# EAGLE schematic wiring (EAGLE 7.4.0)
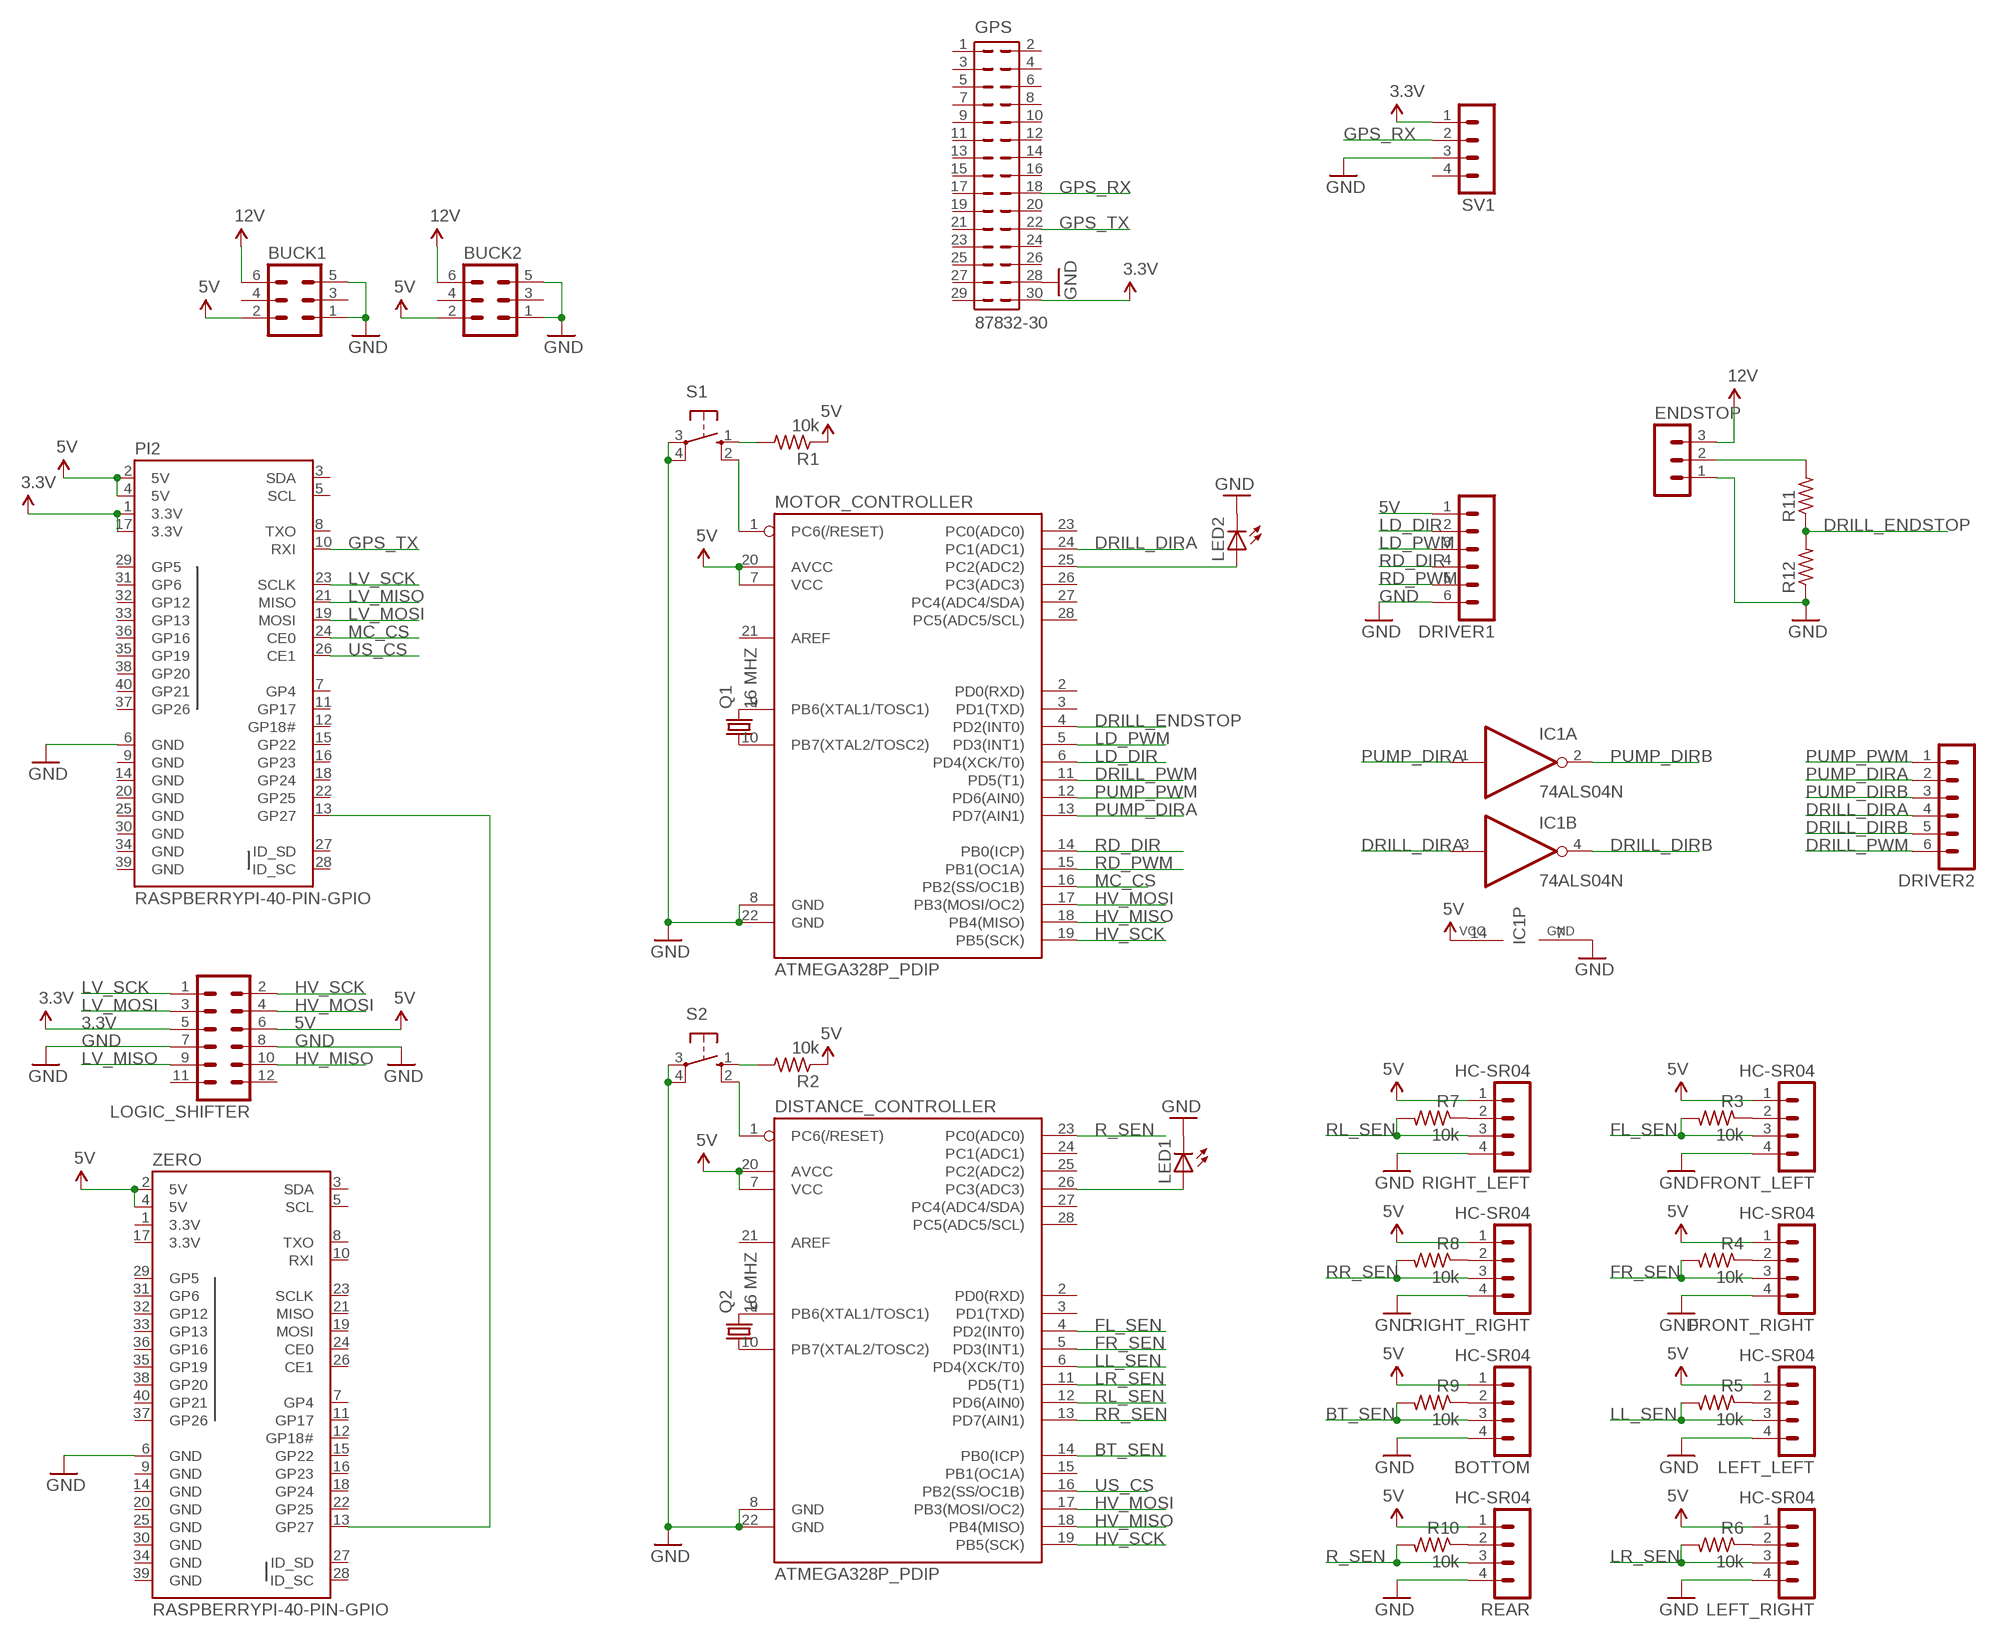
[diagram p0: schematic, sheet 1]

## Parts
BOTTOM  HC-SR04  MA04-1  [MA04-1]
BUCK1  MA03-2  [MA03-2]
BUCK2  MA03-2  [MA03-2]
DISTANCE_CONTROLLER  ATMEGA328P_PDIP  [DIL28-3]
DRIVER1  MA06-1  [MA06-1]
DRIVER2  MA06-1  [MA06-1]
ENDSTOP  MA03-1  [MA03-1]
FRONT_LEFT  HC-SR04  MA04-1  [MA04-1]
FRONT_RIGHT  HC-SR04  MA04-1  [MA04-1]
GPS  87832-30  [87832-30]
IC1  74ALS04N  [DIL14]
LED1  LED3MM  [LED3MM]
LED2  LED3MM  [LED3MM]
LEFT_LEFT  HC-SR04  MA04-1  [MA04-1]
LEFT_RIGHT  HC-SR04  MA04-1  [MA04-1]
LOGIC_SHIFTER  MA06-2  [MA06-2]
MOTOR_CONTROLLER  ATMEGA328P_PDIP  [DIL28-3]
PI2  RASPBERRYPI-40-PIN-GPIO  [2X20-SHROUDED]
Q1  16 MHZ  CRYSTALHC49S  [HC49/S]
Q2  16 MHZ  CRYSTALHC49S  [HC49/S]
R1  10k  R-US_0204/2V  [0204V]
R2  10k  R-US_0204/2V  [0204V]
R3  10k  R-US_0204/2V  [0204V]
R4  10k  R-US_0204/2V  [0204V]
R5  10k  R-US_0204/2V  [0204V]
R6  10k  R-US_0204/2V  [0204V]
R7  10k  R-US_0204/2V  [0204V]
R8  10k  R-US_0204/2V  [0204V]
R9  10k  R-US_0204/2V  [0204V]
R10  10k  R-US_0204/2V  [0204V]
R11  R-US_0204/2V  [0204V]
R12  R-US_0204/2V  [0204V]
REAR  HC-SR04  MA04-1  [MA04-1]
RIGHT_LEFT  HC-SR04  MA04-1  [MA04-1]
RIGHT_RIGHT  HC-SR04  MA04-1  [MA04-1]
S1  10-XX  [B3F-10XX]
S2  10-XX  [B3F-10XX]
SV1  MA04-1  [MA04-1]
ZERO  RASPBERRYPI-40-PIN-GPIO  [2X20-SHROUDED]

## Nets
3.3V: GPS.30 LOGIC_SHIFTER.5 PI2.1(3.3V) PI2.17(3.3V) SV1.1
5V: BOTTOM.1 BUCK1.2 BUCK2.2 DISTANCE_CONTROLLER.7(VCC) DISTANCE_CONTROLLER.20(AVCC) DRIVER1.1 FRONT_LEFT.1 FRONT_RIGHT.1 IC1.14(P:VCC) LEFT_LEFT.1 LEFT_RIGHT.1 LOGIC_SHIFTER.6 MOTOR_CONTROLLER.7(VCC) MOTOR_CONTROLLER.20(AVCC) PI2.2(5V) PI2.4(5V) R1.1 R2.1 REAR.1 RIGHT_LEFT.1 RIGHT_RIGHT.1 ZERO.2(5V) ZERO.4(5V)
12V: BUCK1.6 BUCK2.6 ENDSTOP.3
BT_SEN: BOTTOM.3 DISTANCE_CONTROLLER.14(PB0(ICP)) R9.2
DRILL_DIRA: DRIVER2.4 IC1.3(B:I) MOTOR_CONTROLLER.24(PC1(ADC1))
DRILL_DIRB: DRIVER2.5 IC1.4(B:O)
DRILL_ENDSTOP: MOTOR_CONTROLLER.4(PD2(INT0)) R11.1 R12.2
DRILL_PWM: DRIVER2.6 MOTOR_CONTROLLER.11(PD5(T1))
FL_SEN: DISTANCE_CONTROLLER.4(PD2(INT0)) FRONT_LEFT.3 R3.2
FR_SEN: DISTANCE_CONTROLLER.5(PD3(INT1)) FRONT_RIGHT.3 R4.2
GND: BOTTOM.4 BUCK1.1 BUCK1.5 BUCK2.1 BUCK2.5 DISTANCE_CONTROLLER.8(GND) DISTANCE_CONTROLLER.22(GND) DRIVER1.6 ENDSTOP.1 FRONT_LEFT.4 FRONT_RIGHT.4 GPS.28 IC1.7(P:GND) LED1.K(C) LED2.K(C) LEFT_LEFT.4 LEFT_RIGHT.4 LOGIC_SHIFTER.7 LOGIC_SHIFTER.8 MOTOR_CONTROLLER.8(GND) MOTOR_CONTROLLER.22(GND) PI2.6(GND) R12.1 REAR.4 RIGHT_LEFT.4 RIGHT_RIGHT.4 S1.3(P) S1.4(P1) S2.3(P) S2.4(P1) SV1.3 ZERO.6(GND)
GPS_RX: GPS.18 SV1.2
GPS_TX: GPS.22 PI2.10(RXI)
HV_MISO: DISTANCE_CONTROLLER.18(PB4(MISO)) LOGIC_SHIFTER.10 MOTOR_CONTROLLER.18(PB4(MISO))
HV_MOSI: DISTANCE_CONTROLLER.17(PB3(MOSI/OC2)) LOGIC_SHIFTER.4 MOTOR_CONTROLLER.17(PB3(MOSI/OC2))
HV_SCK: DISTANCE_CONTROLLER.19(PB5(SCK)) LOGIC_SHIFTER.2 MOTOR_CONTROLLER.19(PB5(SCK))
LD_DIR: DRIVER1.2 MOTOR_CONTROLLER.6(PD4(XCK/T0))
LD_PWM: DRIVER1.3 MOTOR_CONTROLLER.5(PD3(INT1))
LL_SEN: DISTANCE_CONTROLLER.6(PD4(XCK/T0)) LEFT_LEFT.3 R5.2
LR_SEN: DISTANCE_CONTROLLER.11(PD5(T1)) LEFT_RIGHT.3 R6.2
LV_MISO: LOGIC_SHIFTER.9 PI2.21(MISO)
LV_MOSI: LOGIC_SHIFTER.3 PI2.19(MOSI)
LV_SCK: LOGIC_SHIFTER.1 PI2.23(SCLK)
MC_CS: MOTOR_CONTROLLER.16(PB2(SS/OC1B)) PI2.24(CE0)
N$1: R1.2 S1.1(S)
N$2: MOTOR_CONTROLLER.1(PC6(/RESET)) S1.2(S1)
N$3: DISTANCE_CONTROLLER.1(PC6(/RESET)) S2.2(S1)
N$4: DISTANCE_CONTROLLER.26(PC3(ADC3)) LED1.A
N$5: LED2.A MOTOR_CONTROLLER.25(PC2(ADC2))
N$6: R2.2 S2.1(S)
N$7: FRONT_RIGHT.2 R4.1
N$8: MOTOR_CONTROLLER.9(PB6(XTAL1/TOSC1)) Q1.2
N$9: FRONT_LEFT.2 R3.1
N$10: ENDSTOP.2 R11.2
N$11: LEFT_LEFT.2 R5.1
N$12: MOTOR_CONTROLLER.10(PB7(XTAL2/TOSC2)) Q1.1
N$13: LEFT_RIGHT.2 R6.1
N$14: DISTANCE_CONTROLLER.9(PB6(XTAL1/TOSC1)) Q2.2
N$15: R7.1 RIGHT_LEFT.2
N$16: DISTANCE_CONTROLLER.10(PB7(XTAL2/TOSC2)) Q2.1
N$17: R8.1 RIGHT_RIGHT.2
N$18: PI2.13(GP27) ZERO.13(GP27)
N$19: BOTTOM.2 R9.1
N$21: R10.1 REAR.2
PUMP_DIRA: DRIVER2.2 IC1.1(A:I) MOTOR_CONTROLLER.13(PD7(AIN1))
PUMP_DIRB: DRIVER2.3 IC1.2(A:O)
PUMP_PWM: DRIVER2.1 MOTOR_CONTROLLER.12(PD6(AIN0))
R_SEN: DISTANCE_CONTROLLER.23(PC0(ADC0)) R10.2 REAR.3
RD_DIR: DRIVER1.4 MOTOR_CONTROLLER.14(PB0(ICP))
RD_PWM: DRIVER1.5 MOTOR_CONTROLLER.15(PB1(OC1A))
RL_SEN: DISTANCE_CONTROLLER.12(PD6(AIN0)) R7.2 RIGHT_LEFT.3
RR_SEN: DISTANCE_CONTROLLER.13(PD7(AIN1)) R8.2 RIGHT_RIGHT.3
US_CS: DISTANCE_CONTROLLER.16(PB2(SS/OC1B)) PI2.26(CE1)
Unconnected: BUCK1.3 BUCK1.4 BUCK2.3 BUCK2.4 DISTANCE_CONTROLLER.2(PD0(RXD)) DISTANCE_CONTROLLER.3(PD1(TXD)) DISTANCE_CONTROLLER.15(PB1(OC1A)) DISTANCE_CONTROLLER.21(AREF) DISTANCE_CONTROLLER.24(PC1(ADC1)) DISTANCE_CONTROLLER.25(PC2(ADC2)) DISTANCE_CONTROLLER.27(PC4(ADC4/SDA)) DISTANCE_CONTROLLER.28(PC5(ADC5/SCL)) GPS.1 GPS.2 GPS.3 GPS.4 GPS.5 GPS.6 GPS.7 GPS.8 GPS.9 GPS.10 GPS.11 GPS.12 GPS.13 GPS.14 GPS.15 GPS.16 GPS.17 GPS.19 GPS.20 GPS.21 GPS.23 GPS.24 GPS.25 GPS.26 GPS.27 GPS.29 IC1.5(C:I) IC1.6(C:O) IC1.8(D:O) IC1.9(D:I) IC1.10(E:O) IC1.11(E:I) IC1.12(F:O) IC1.13(F:I) LOGIC_SHIFTER.11 LOGIC_SHIFTER.12 MOTOR_CONTROLLER.2(PD0(RXD)) MOTOR_CONTROLLER.3(PD1(TXD)) MOTOR_CONTROLLER.21(AREF) MOTOR_CONTROLLER.23(PC0(ADC0)) MOTOR_CONTROLLER.26(PC3(ADC3)) MOTOR_CONTROLLER.27(PC4(ADC4/SDA)) MOTOR_CONTROLLER.28(PC5(ADC5/SCL)) PI2.3(SDA) PI2.5(SCL) PI2.7(GP4) PI2.8(TXO) PI2.11(GP17) PI2.12(GP18#) PI2.15(GP22) PI2.16(GP23) PI2.18(GP24) PI2.22(GP25) PI2.27(ID_SD) PI2.28(ID_SC) PI2.29(GP5) PI2.31(GP6) PI2.32(GP12) PI2.33(GP13) PI2.35(GP19) PI2.36(GP16) PI2.37(GP26) PI2.38(GP20) PI2.40(GP21) SV1.4 ZERO.3(SDA) ZERO.5(SCL) ZERO.7(GP4) ZERO.8(TXO) ZERO.10(RXI) ZERO.11(GP17) ZERO.12(GP18#) ZERO.15(GP22) ZERO.16(GP23) ZERO.18(GP24) ZERO.19(MOSI) ZERO.21(MISO) ZERO.22(GP25) ZERO.23(SCLK) ZERO.24(CE0) ZERO.26(CE1) ZERO.27(ID_SD) ZERO.28(ID_SC) ZERO.29(GP5) ZERO.31(GP6) ZERO.32(GP12) ZERO.33(GP13) ZERO.35(GP19) ZERO.36(GP16) ZERO.37(GP26) ZERO.38(GP20) ZERO.40(GP21)

## Power pins joined to a net without a drawn wire
3.3V: ZERO.1(3.3V) ZERO.17(3.3V)
GND: PI2.9(GND) PI2.14(GND) PI2.20(GND) PI2.25(GND) PI2.30(GND) PI2.34(GND) PI2.39(GND) ZERO.9(GND) ZERO.14(GND) ZERO.20(GND) ZERO.25(GND) ZERO.30(GND) ZERO.34(GND) ZERO.39(GND)

## Library data of the parts
BOTTOM FRONT_LEFT FRONT_RIGHT LEFT_LEFT LEFT_RIGHT REAR RIGHT_LEFT RIGHT_RIGHT SV1 = con-lstb:MA04-1: PIN HEADER; OC_FARNELL: unknown; OC_NEWARK: unknown
BUCK1 BUCK2 = con-lstb:MA03-2: PIN HEADER; OC_FARNELL: unknown; OC_NEWARK: unknown
DISTANCE_CONTROLLER MOTOR_CONTROLLER = SparkFun-DigitalIC:ATMEGA328P_PDIP: uC used in the Arduino 32kb flash, 1k EEPROM, 2k SRAM This is the through-hole version of this chip.
DRIVER1 DRIVER2 = con-lstb:MA06-1: PIN HEADER; OC_FARNELL: unknown; OC_NEWARK: unknown
ENDSTOP = con-lstb:MA03-1: PIN HEADER; OC_FARNELL: unknown; OC_NEWARK: unknown
GPS = con-molex:87832-30: Milli-Grid Header 2.00mm (.079") Pitch; OC_FARNELL: unknown; OC_NEWARK: unknown
IC1 = 74xx-us:74*04: Hex INVERTER
LED1 LED2 = led:LED: LED OSRAM: - CHIPLED LG R971, LG N971, LY N971, LG Q971, LY Q971, LO R971, LY R971 LH N974, LH R974 LS Q976, LO Q976, LY Q976 LO Q996 - Hyper CHIPLED LW Q18S LB Q993, LB Q99A, LB R99A - SideLED LS A670, LO A670, LY A670, LG A670, LP A670 LB A673, LV A673, LT A673, LW A673 LH A674 LY A675 LS A676, LA A676, LO A676, LY A676, LW A676 LS A679, LY A679, LG A679 - Hyper Micro SIDELED® LS Y876, LA Y876, LO Y876, LY Y876 LT Y87S - SmartLED LW L88C, LW L88S LB L89C, LB L89S, LG L890 LS L89K, LO L89K, LY L89K LS L896, LA L896, LO L896, LY L896 - TOPLED LS T670, LO T670, LY T670, LG T670, LP T670 LSG T670, LSP T670, LSY T670, LOP T670, LYG T670 LG T671, LOG T671, LSG T671 LB T673, LV T673, LT T673, LW T673 LH T674 LS T676, LA T676, LO T676, LY T676, LB T676, LH T676, LSB T676, LW T676 LB T67C, LV T67C, LT T67C, LS T67K, LO T67K, LY T67K, LW E67C LS E67B, LA E67B, LO E67B, LY E67B, LB E67C, LV E67C, LT E67C LW T67C LS T679, LY T679, LG T679 LS T770, LO T770, LY T770, LG T770, LP T770 LB T773, LV T773, LT T773, LW T773 LH T774 LS E675, LA E675, LY E675, LS T675 LS T776, LA T776, LO T776, LY T776, LB T776 LHGB T686 LT T68C, LB T68C - Hyper Mini TOPLED® LB M676 - Mini TOPLED Santana® LG M470 LS M47K, LO M47K, LY M47K Source: http://www.osram.convergy.de LUXEON: - LUMILED® LXK2-PW12-R00, LXK2-PW12-S00, LXK2-PW14-U00, LXK2-PW14-V00 LXK2-PM12-R00, LXK2-PM12-S00, LXK2-PM14-U00 LXK2-PE12-Q00, LXK2-PE12-R00, LXK2-PE12-S00, LXK2-PE14-T00, LXK2-PE14-U00 LXK2-PB12-K00, LXK2-PB12-L00, LXK2-PB12-M00, LXK2-PB14-N00, LXK2-PB14-P00, LXK2-PB14-Q00 LXK2-PR12-L00, LXK2-PR12-M00, LXK2-PR14-Q00, LXK2-PR14-R00 LXK2-PD12-Q00, LXK2-PD12-R00, LXK2-PD12-S00 LXK2-PH12-R00, LXK2-PH12-S00 LXK2-PL12-P00, LXK2-PL12-Q00, LXK2-PL12-R00 Source: www.luxeon.com KINGBRIGHT: KA-3528ASYC Source: www.kingbright.com
LOGIC_SHIFTER = con-lstb:MA06-2: PIN HEADER; OC_FARNELL: unknown; OC_NEWARK: unknown
PI2 ZERO = SparkFun-Boards:RASPBERRYPI-40-PIN-GPIO: Second Generation Raspberry Pi GPIO Header 2x20 pin connector, as found on B, B+, A+ models.
Q1 Q2 = crystal:CRYSTAL: CRYSTAL; OC_FARNELL: 1667008; OC_NEWARK: unknown
R1-R12 = rcl:R-US_: RESISTOR, American symbol
S1 S2 = switch-omron:10-XX: OMRON SWITCH; MPN: B3F-1000; OC_FARNELL: 176432; OC_NEWARK: 36M3542